# EAGLE design untitled_double_sided_AA (EAGLE 6.1)
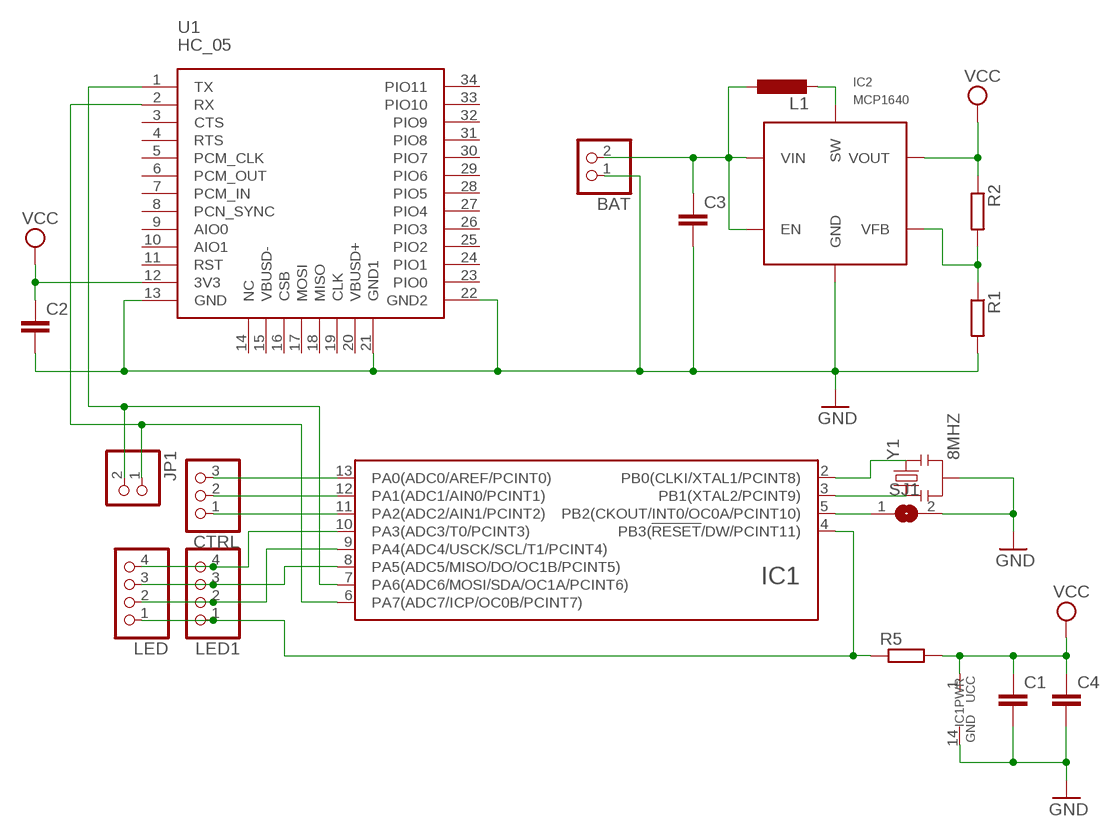
[diagram p0: schematic, sheet 1]

## Parts
BAT  PINHD-1X2  [1X02]
C1  C-EUC0805K  [C0805K]
C2  C-EUC0805K  [C0805K]
C3  C-EUC0805K  [C0805K]
C4  C-EUC0805K  [C0805K]
CTRL  PINHD-1X3  [1X03]
IC1  ATTINY24/44/84-SSU  [SOIC14]
IC2  MCP1640  [SOT23-6]
JP1  PINHD-1X2  [1X02]
L1  L-EU0204V  [0204V]
LED  PINHD-1X4  [1X04]
LED1  PINHD-1X4  [1X04]
R1  R-EU_M0805  [M0805]
R2  R-EU_M0805  [M0805]
R5  R-EU_M0805  [M0805]
SJ1  SJ  [SJ]
U1  HC_05  [BLUETOOTH_SMD]
Y1  8MHZ  RESONATOR8MHZ  [RESONATOR-SMD]

## Nets
GND: BAT.1 C1.2 C2.2 C3.2 C4.2 IC1.14(GND) IC2.2(GND) R1.2 SJ1.2 U1.13(GND) U1.21(GND1) U1.22(GND2) Y1.2
N$1: IC1.3(PB1(XTAL2/PCINT9)) Y1.1
N$2: IC1.2(PB0(CLKI/XTAL1/PCINT8)) Y1.3
N$3: IC1.7(PA6(ADC6/MOSI/SDA/OC1A/PCINT6)) JP1.2 U1.1(TX)
N$4: CTRL.1 IC1.11(PA2(ADC2/AIN1/PCINT2))
N$5: IC1.6(PA7(ADC7/ICP/OC0B/PCINT7)) JP1.1 U1.2(RX)
N$6: IC1.8(PA5(ADC5/MISO/DO/OC1B/PCINT5)) LED1.3 LED.3
N$7: CTRL.2 IC1.12(PA1(ADC1/AIN0/PCINT1))
N$8: CTRL.3 IC1.13(PA0(ADC0/AREF/PCINT0))
N$9: IC1.9(PA4(ADC4/USCK/SCL/T1/PCINT4)) LED1.2 LED.2
N$12: IC1.5(PB2(CKOUT/INT0/OC0A/PCINT10)) SJ1.1
N$13: BAT.2 C3.1 IC2.3(EN) IC2.6(VIN) L1.1
N$14: IC2.4(VFB) R1.1 R2.2
N$16: IC2.1(SW) L1.2
N$17: IC1.4(PB3(!RESET!/DW/PCINT11)) LED1.1 LED.1 R5.1
N$20: IC1.10(PA3(ADC3/T0/PCINT3)) LED1.4 LED.4
VCC: C1.1 C2.1 C4.1 IC1.1(UCC) IC2.5(VOUT) R2.1 R5.2 U1.12(3V3)
Unconnected: U1.3(CTS) U1.4(RTS) U1.5(PCM_CLK) U1.6(PCM_OUT) U1.7(PCM_IN) U1.8(PCN_SYNC) U1.9(AIO0) U1.10(AIO1) U1.11(RST) U1.14(NC) U1.15(VBUSD-) U1.16(CSB) U1.17(MOSI) U1.18(MISO) U1.19(CLK) U1.20(VBUSD+) U1.23(PIO0) U1.24(PIO1) U1.25(PIO2) U1.26(PIO3) U1.27(PIO4) U1.28(PIO5) U1.29(PIO6) U1.30(PIO7) U1.31(PIO8) U1.32(PIO9) U1.33(PIO10) U1.34(PIO11)

## Library data of the parts
BAT JP1 = pinhead:PINHD-1X2: PIN HEADER
C1-C4 = rcl:C-EU: CAPACITOR, European symbol
CTRL = pinhead:PINHD-1X3: PIN HEADER
IC1 = atmel_tiny24-44-84tiny48-88mega48-88-168-328:ATTINY24/44/84
IC2 = SteveMarple:MCP1640: MCP1640 0.65V Start-up Synchronous Boost Regulator with True Output Disconnect or Input/Output Bypass Option
L1 = rcl:L-EU: INDUCTOR, European symbol
LED LED1 = pinhead:PINHD-1X4: PIN HEADER
R1 R2 R5 = rcl:R-EU_: RESISTOR, European symbol
SJ1 = jumper:SJ: SMD solder JUMPER
U1 = SerialPortBluetooth:HC_05
Y1 = SparkFun-FreqCtrl:RESONATOR: Resonator Small SMD resonator. Used, eg, on the Arduino Pro/ Pro Mini boards. 8MHz- XTAL-08895 16MHz- XTAL-08900; PROD_ID: XTAL-08895

## Board
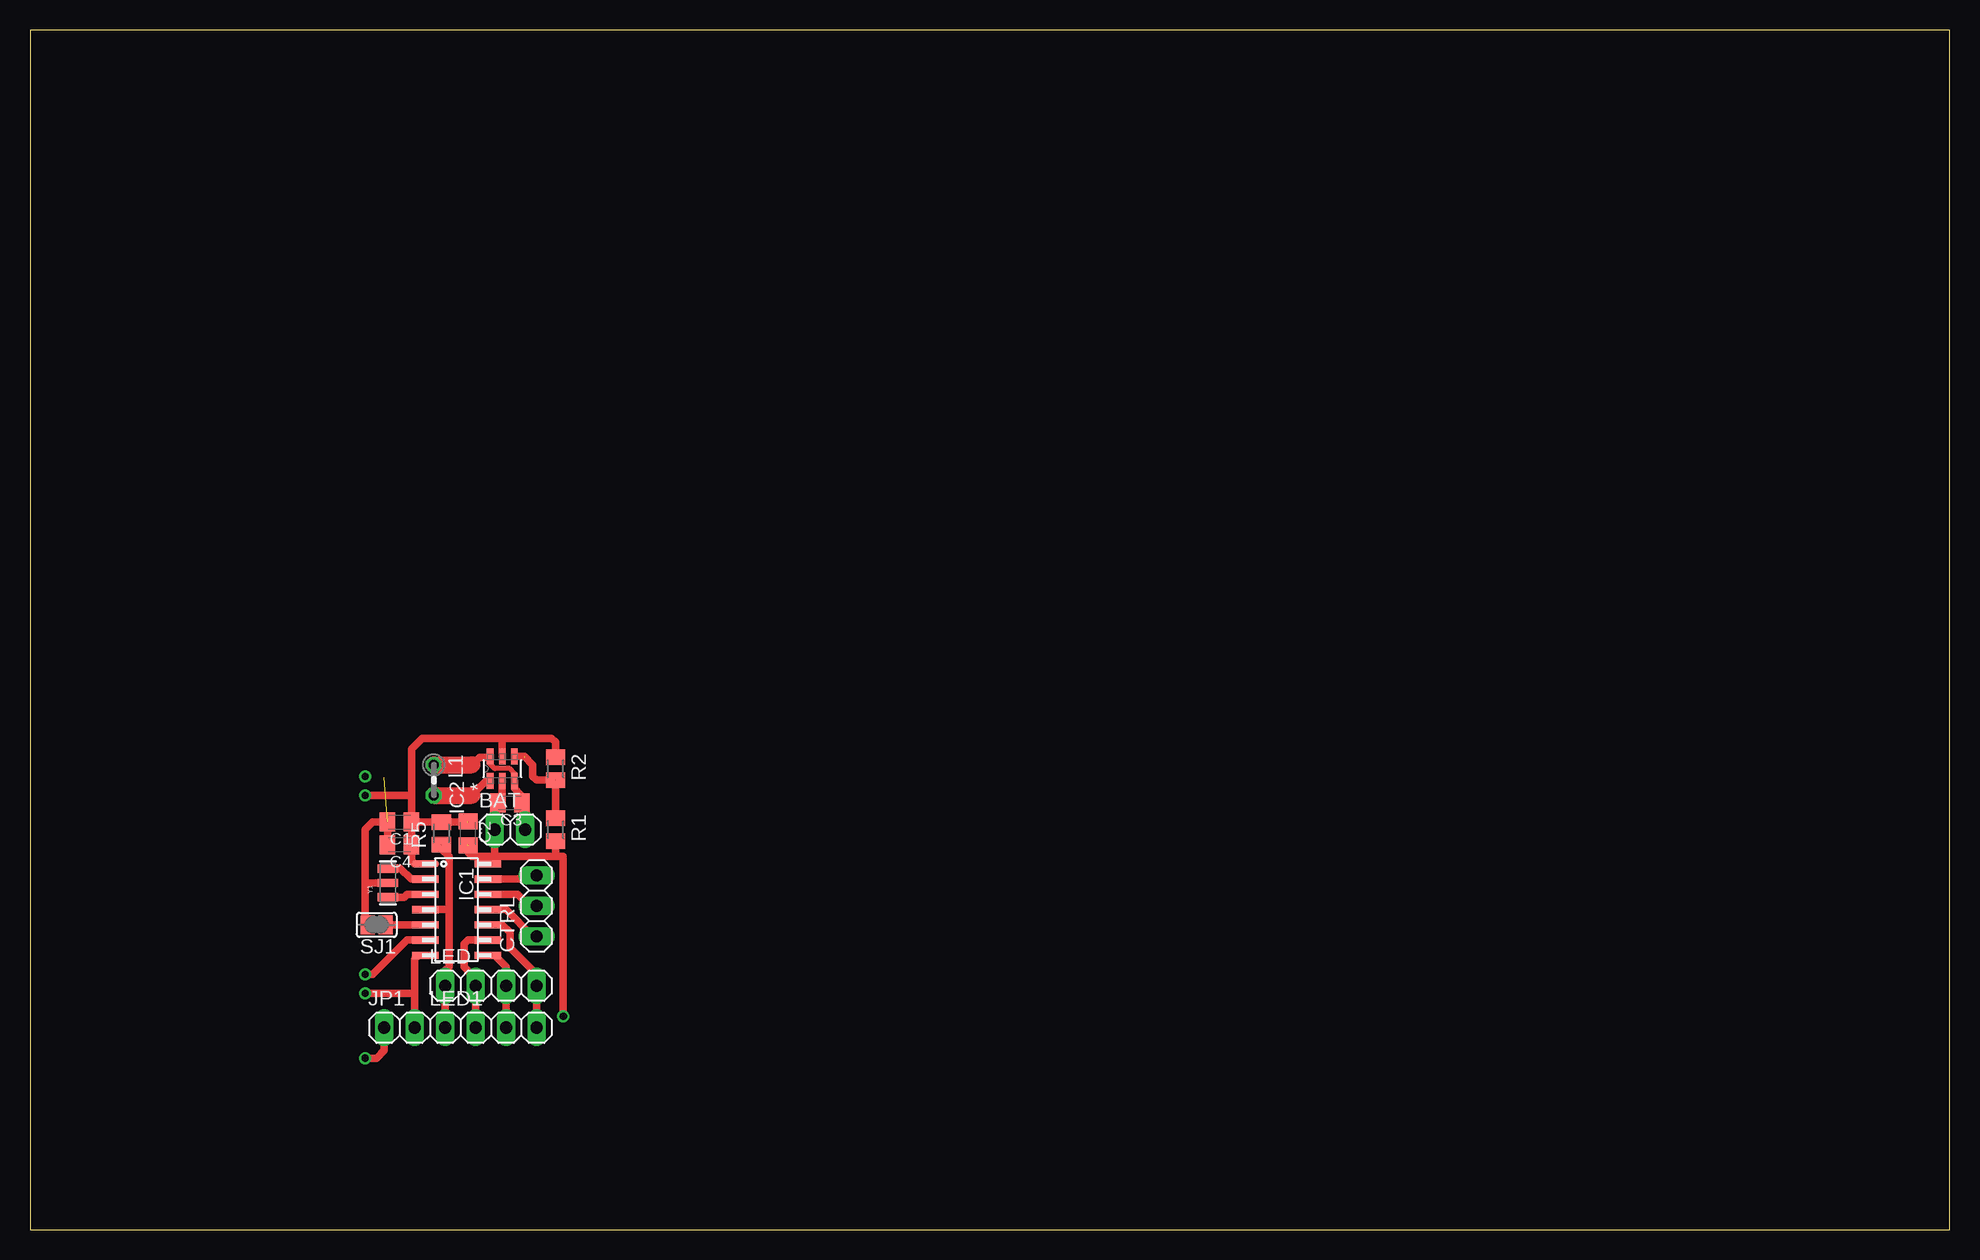
[diagram p1: board, top side]
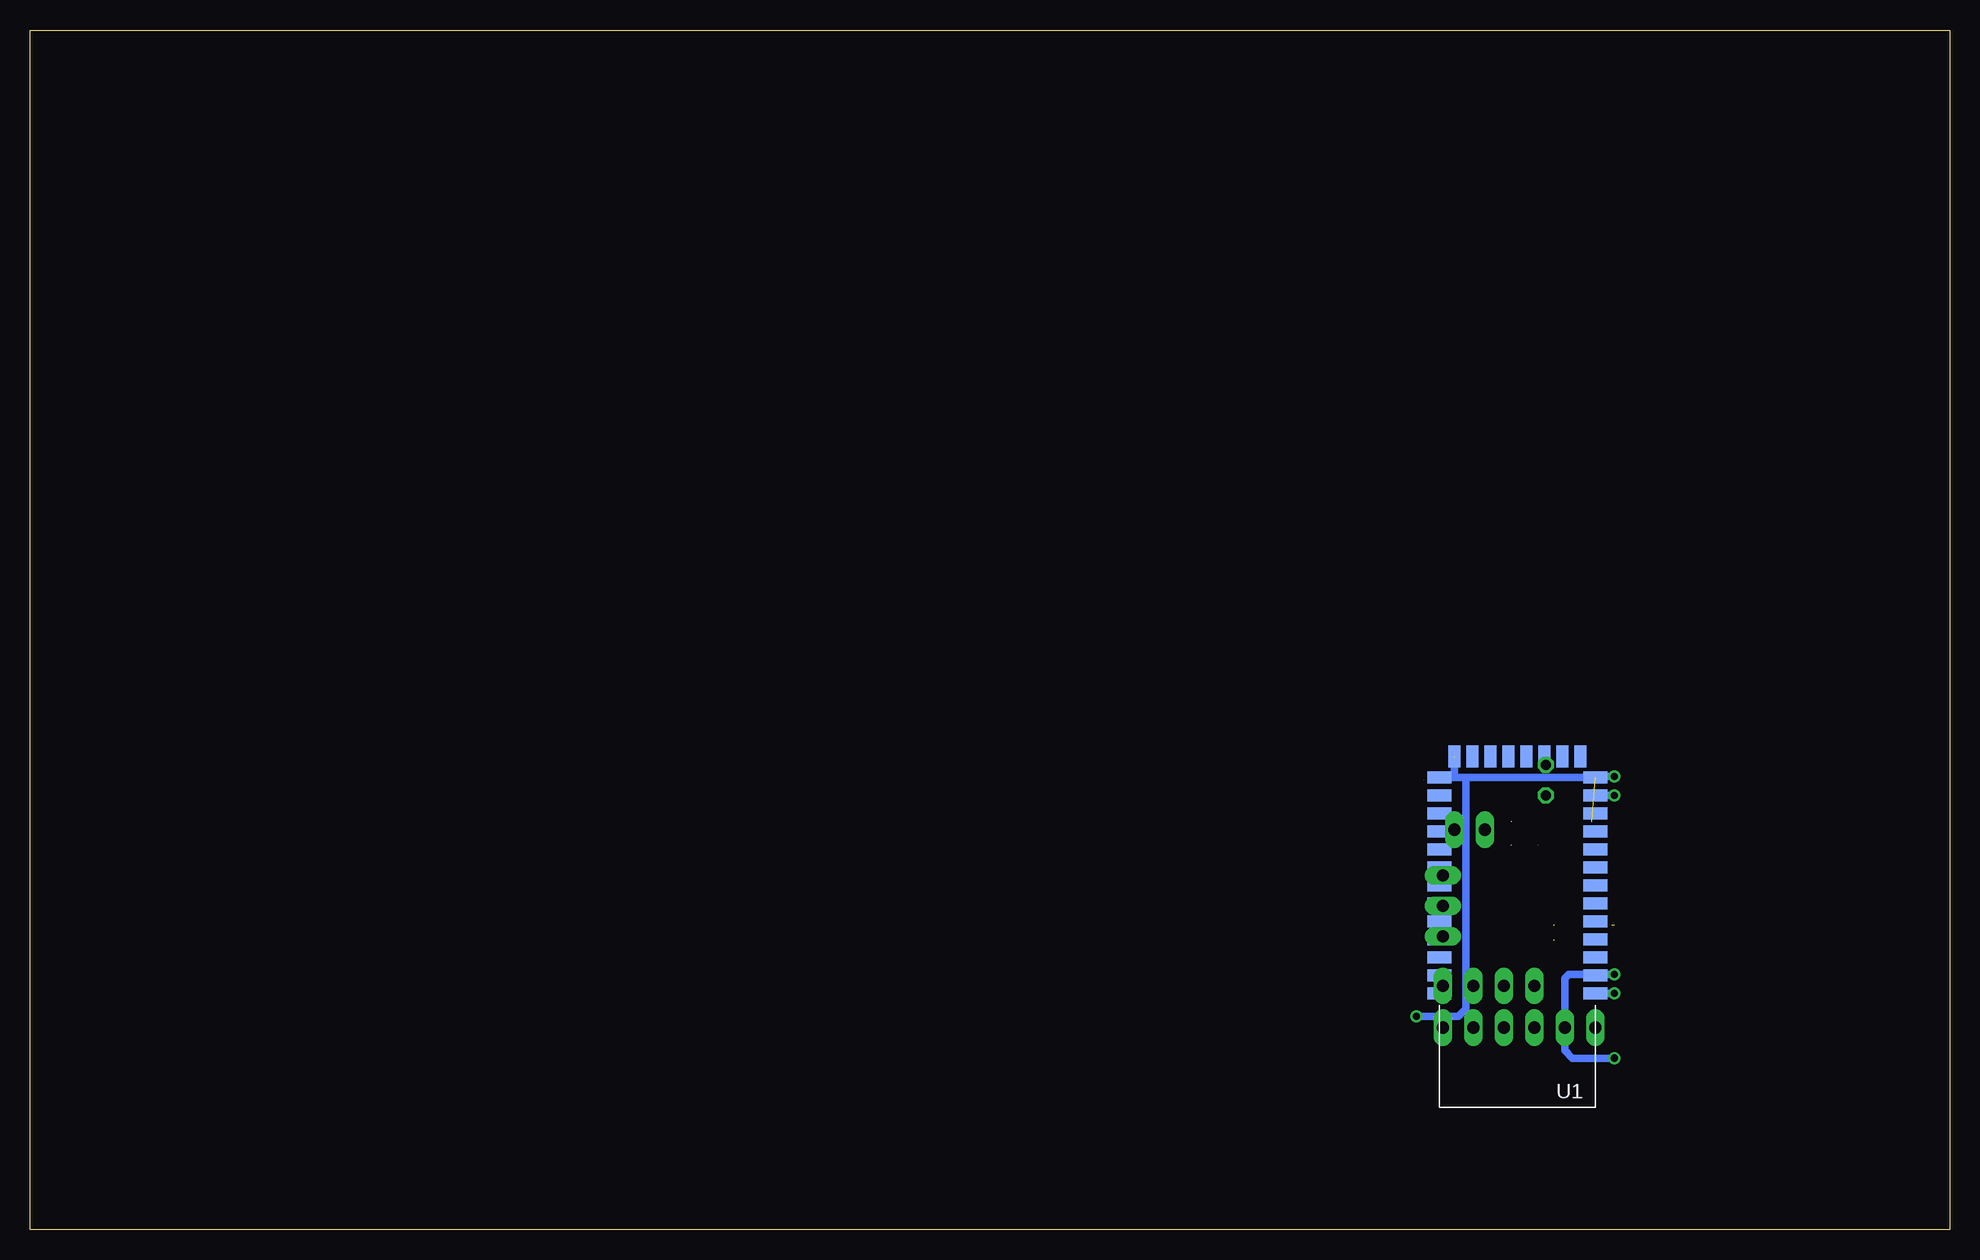
[diagram p2: board, bottom side, seen from below]

Size 160 x 100 mm. Coordinates in mm from the lower left corner, seen from the top.
Outline: 0,0 160,0 160,100 0,100 0,0
Copper layers (1*16): Top 0.035mm / dielectric 1.5mm / Bottom 0.035mm
Design rules: minimum track width 10mil, minimum drill 24mil, track to track 8mil, track to pad 8mil, pad to pad 8mil, via to via 8mil, smd to smd 8mil, copper to edge 40mil, drill to drill 8mil, minimum pad ring 10mil, minimum via ring 8mil, stop-mask expansion 4mil, vias tented up to drill 0mil, thermal gap 10mil

### Footprints (pad centres in the part's own frame; a part is rotated, then mirrored left to right if it is on the bottom)
1X02 = drill 1.016 long: 1 -1.27,0; 2 1.27,0
C0805K = smd 1.3 x 1.6: 1 -1,0; 2 1,0
1X03 = drill 1.016 long: 1 -2.54,0; 2 0,0; 3 2.54,0
SOIC14 = smd 0.61 x 2.21: 1 -3.81,-2.603; 2 -2.54,-2.603; 3 -1.27,-2.603; 4 0,-2.603; 5 1.27,-2.603; 6 2.54,-2.603; 7 3.81,-2.603; 8 3.81,2.603; 9 2.54,2.603; 10 1.27,2.603; 11 0,2.603; 12 -1.27,2.603; 13 -2.54,2.603; 14 -3.81,2.603
SOT23-6 = smd 1.321 x 0.559: 1 -1.016,1.016; 2 -1.016,0; 3 -1.016,-1.016; 4 1.016,-1.016; 5 1.016,0; 6 1.016,1.016
0204V = drill 0.813 octagon: 1 -1.27,0; 2 1.27,0
1X04 = drill 1.016 long: 1 -3.81,0; 2 -1.27,0; 3 1.27,0; 4 3.81,0
M0805 = smd 1.3 x 1.6: 1 -0.95,0; 2 0.95,0
SJ = smd 1.168 x 1.6: 1 -0.762,0; 2 0.762,0
BLUETOOTH_SMD = smd 2 x 1: 1 0,0; 2 0,-1.5; 3 0,-3; 4 0,-4.5; 5 0,-6; 6 0,-7.5; 7 0,-9; 8 0,-10.5; 9 0,-12; 10 0,-13.5; 11 0,-15; 12 0,-16.5; 13 0,-18; 22 13,-18; 23 13,-16.5; 24 13,-15; 25 13,-13.5; 26 13,-12; 27 13,-10.5; 28 13,-9; 29 13,-7.5; 30 13,-6; 31 13,-4.5; 32 13,-3; 33 13,-1.5; 34 13,0 | smd 1 x 1.8: 14 1.25,-19.75; 15 2.75,-19.75; 16 4.25,-19.75; 17 5.75,-19.75; 18 7.25,-19.75; 19 8.75,-19.75; 20 10.25,-19.75; 21 11.75,-19.75
RESONATOR-SMD = smd 0.7 x 1.7: 1 -1.2,0; 2 0,0; 3 1.2,0

### Placement (x,y rotation side)
BAT  40.01,33.34 0 top
C1  30.8,33.97 180 top
C2  36.51,33.02 270 top
C3  40.01,35.56 180 top
C4  30.8,32.07 180 top
CTRL  42.23,26.99 90 top
IC1  35.56,26.67 270 top
IC2  39.37,38.42 90 top
JP1  30.8,16.83 0 top
L1  33.66,37.47 270 top
LED  38.42,20.32 0 top
LED1  38.42,16.83 0 top
R1  43.81,33.34 270 top
R2  43.81,38.42 270 top
R5  34.29,33.02 90 top
SJ1  28.89,25.4 180 top
U1  29.53,19.68 180 bottom
Y1  29.84,28.89 90 top

### Tracks (layer width: path | path; a pad name or v marks a point on that pad's centre or on a via)
GND  (via drill 0.6)  (4 unrouted)
  Top 0.61: 38.42,30.48 IC1.14 38.73,31.05 38.73,31.11 | 38.73,31.11 43.81,31.11 | 43.81,31.11 44.45,31.11 v44.45,17.78 | 43.81,31.11 R1.2 | 38.73,31.11 BAT.1 38.73,35.29 C3.2 39.37,35.92 IC2.2 | 38.73,31.11 36.83,31.11 36.51,31.43 36.51,32.07 | Y1.2 27.94,28.89 | 27.94,28.89 27.94,33.34 28.57,33.97 C1.2 | C1.2 29.84,33.97 | C4.2 C1.2 | 27.94,28.89 27.94,25.4 | 27.99,37.83 v27.94,37.78
  Bottom 0.406: 29.62,37.69 27.94,37.69 v27.94,37.78
  Bottom 0.61: 41.27,37.69 41.27,39.37 | U1.22 41.27,37.69 | 40.32,37.69 29.62,37.69 | 29.62,37.69 29.53,37.78 | 29.62,37.69 U1.13 28.99,37.69 28.89,37.78 v27.94,37.78 | 41.27,37.69 40.32,37.69 | 40.32,37.69 40.32,18.41 40.96,17.78 v44.45,17.78
N$1
  Top 0.61: Y1.1 31.18,27.69 31.43,27.94 IC1.3
N$2
  Top 0.61: Y1.3 30.87,30.09 31.75,29.21 IC1.2
N$3  (via drill 0.6)
  Top 0.61: IC1.7 32.38,22.86 32.07,22.54 32.07,19.68 | 32.07,19.68 JP1.2 | v27.94,19.68 32.07,19.68
  Bottom 0.61: v27.94,19.68 U1.1
N$4
  Top 0.61: IC1.11 39.69,26.67 41.91,24.45 CTRL.1
N$5  (via drill 0.6)  (1 unrouted)
  Top 0.61: 33.02,24.13 31.43,24.13 28.57,21.27 v27.94,21.27 | v27.94,14.29 28.89,14.29 29.53,14.92 JP1.1
  Bottom 0.61: U1.2 29.53,21.27 v27.94,21.27 31.75,21.27 32.07,20.95 32.07,14.92 31.43,14.29 v27.94,14.29
N$6
  Top 0.61: IC1.8 38.73,22.86 39.69,21.91 LED.3 LED1.3
N$7
  Top 0.61: IC1.12 40.64,27.94 41.59,26.99 CTRL.2
N$8
  Top 0.61: IC1.13 41.91,29.21 CTRL.3
N$9
  Top 0.61: IC1.9 36.51,24.13 36.2,23.81 36.2,21.91 37.15,20.95 LED.2 LED1.2
N$12  (1 unrouted)
  Top 0.61: SJ1.1 33.02,25.4
N$13
  Top 0.406: IC2.3 40.39,38.04 40.01,38.42 38.73,38.42 38.35,38.8 IC2.6
  Top 0.61: BAT.2 41.27,35.29 C3.1 40.96,35.61 40.96,36.2 40.39,36.77 IC2.3 | 36.83,38.73 37.47,39.37 38.29,39.37 IC2.6
  Top 1.422: L1.1 36.83,38.73
N$14  (1 unrouted)
  Top 0.61: R1.1 R2.2 | IC2.4 41.21,39.43 41.91,38.73 41.91,37.78 42.23,37.47 R2.2
N$16
  Top 0.61: 36.83,36.2 38.04,37.4 IC2.1
  Top 1.422: L1.2 36.83,36.2
N$17  (1 unrouted)
  Top 0.61: IC1.4 34.92,26.67 | LED1.1 LED.1 34.61,21.59 34.92,21.91 34.92,26.67 | 34.92,26.67 34.92,31.11 34.29,31.75 R5.1
N$20
  Top 0.61: IC1.10 39.37,25.4 40.01,24.77 40.01,23.5 42.23,21.27 LED.4 LED1.4
VCC  (via drill 0.6)  (1 unrouted)
  Top 0.61: R2.1 43.81,40.64 43.5,40.96 39.37,40.96 | 39.37,40.96 IC2.5 | IC1.1 32.07,30.48 31.8,30.75 C4.1 C1.1 | C1.1 R5.2 36.46,33.97 | 27.99,36.15 v27.94,36.2 31.8,36.2 | 39.37,40.96 32.7,40.96 31.8,40.05 31.8,36.2 | C1.1 31.8,36.2
  Bottom 0.61: U1.12 28.9,36.19 28.89,36.2 v27.94,36.2